# Altium schematic sheet Connector.SchDoc
size A4; SheetNumber: 6; SheetTotal: 11
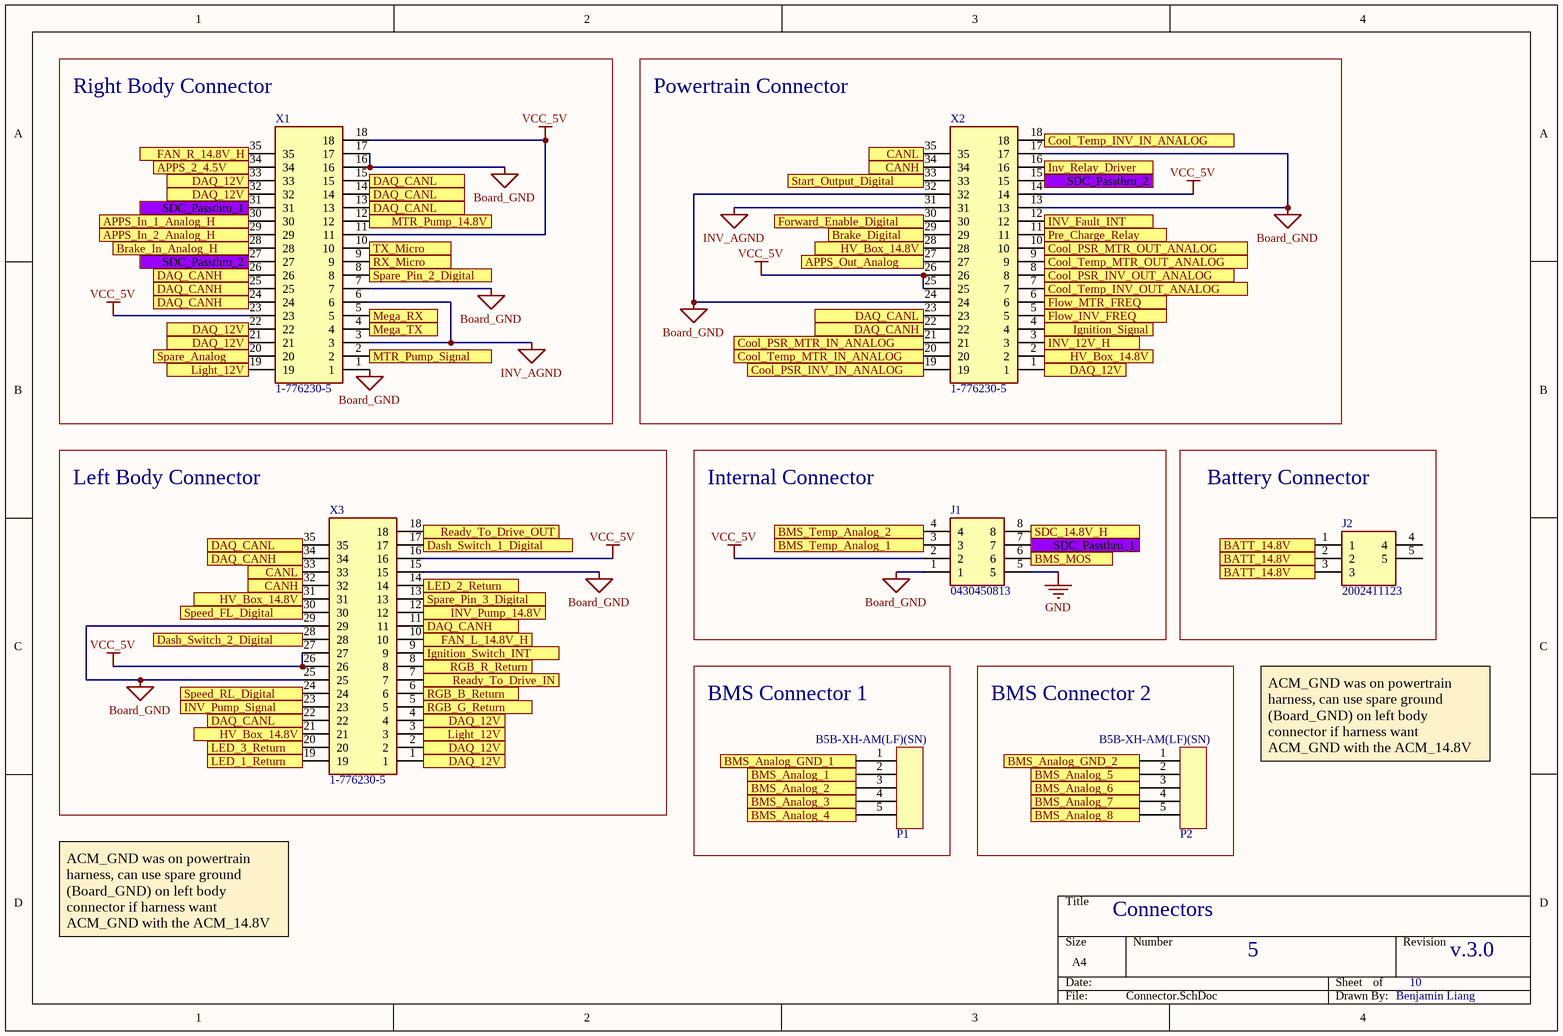
[diagram p0: Connector.SchDoc]

## Parts
J1  0430450813  [0430450813]
J2  2002411123  [2002411YY3_11/12/13]
P1  B5B-XH-AM(LF)(SN)  [B5B-XH-AM(LF)(SN)]  (value not drawn)
P2  B5B-XH-AM(LF)(SN)  [B5B-XH-AM(LF)(SN)]  (value not drawn)
X1  1-776230-5  [17762305]
X2  1-776230-5  [17762305]
X3  1-776230-5  [17762305]

## Blocks framed on the sheet
Right Body Connector: X1
Powertrain Connector: X2
Left Body Connector: X3
Internal Connector: J1
Battery Connector: J2
BMS Connector 1: P1
BMS Connector 2: P2

## Ports
APPS_2_4.5V, APPS_In_1_Analog_H, APPS_In_2_Analog_H, APPS_Out_Analog, BATT_14.8V, BMS_Analog_1, BMS_Analog_2, BMS_Analog_3, BMS_Analog_4, BMS_Analog_5, BMS_Analog_6, BMS_Analog_7, BMS_Analog_8, BMS_Analog_GND_1, BMS_Analog_GND_2, BMS_MOS, BMS_Temp_Analog_1, BMS_Temp_Analog_2, Brake_Digital, Brake_In_Analog_H, CANH, CANL, Cool_PSR_INV_IN_ANALOG, Cool_PSR_INV_OUT_ANALOG, Cool_PSR_MTR_IN_ANALOG, Cool_PSR_MTR_OUT_ANALOG, Cool_Temp_INV_IN_ANALOG, Cool_Temp_INV_OUT_ANALOG, Cool_Temp_MTR_IN_ANALOG, Cool_Temp_MTR_OUT_ANALOG, DAQ_12V, DAQ_CANH, DAQ_CANL, Dash_Switch_1_Digital, Dash_Switch_2_Digital, FAN_L_14.8V_H, FAN_R_14.8V_H, Flow_INV_FREQ, Flow_MTR_FREQ, Forward_Enable_Digital, HV_Box_14.8V, Ignition_Signal, Ignition_Switch_INT, INV_12V_H, INV_Fault_INT, INV_Pump_14.8V, INV_Pump_Signal, Inv_Relay_Driver, LED_1_Return, LED_2_Return, LED_3_Return, Light_12V, Mega_RX, Mega_TX, MTR_Pump_14.8V, MTR_Pump_Signal, Pre_Charge_Relay, Ready_To_Drive_IN, Ready_To_Drive_OUT, RGB_B_Return, RGB_G_Return, RGB_R_Return, RX_Micro, SDC_14.8V_H, SDC_Passthru_1, SDC_Passthru_2, Spare_Analog, Spare_Pin_2_Digital, Spare_Pin_3_Digital, Speed_FL_Digital, Speed_RL_Digital, Start_Output_Digital, TX_Micro

## Nets
Board_GND: J1.1 X1.1 X1.7 X1.16 X1.17 X2.13 X2.17 X2.24 X2.32 X3.15 X3.25 X3.29
GND: J1.5
INV_AGND: X1.3 X1.6 X2.31
VCC_5V: J1.2 X1.11 X1.18 X1.23 X2.14 X2.25 X2.26 X3.16 X3.26 X3.27
APPS_2_4.5V: X1.34 ; port APPS_2_4.5V
APPS_In_1_Analog_H: X1.30 ; port APPS_In_1_Analog_H
APPS_In_2_Analog_H: X1.29 ; port APPS_In_2_Analog_H
APPS_Out_Analog: X2.27 ; port APPS_Out_Analog
BATT_14.8V: J2.1 J2.2 J2.3 ; port BATT_14.8V
BMS_Analog_1: P1.2 ; port BMS_Analog_1
BMS_Analog_2: P1.3 ; port BMS_Analog_2
BMS_Analog_3: P1.4 ; port BMS_Analog_3
BMS_Analog_4: P1.5 ; port BMS_Analog_4
BMS_Analog_5: P2.2 ; port BMS_Analog_5
BMS_Analog_6: P2.3 ; port BMS_Analog_6
BMS_Analog_7: P2.4 ; port BMS_Analog_7
BMS_Analog_8: P2.5 ; port BMS_Analog_8
BMS_Analog_GND_1: P1.1 ; port BMS_Analog_GND_1
BMS_Analog_GND_2: P2.1 ; port BMS_Analog_GND_2
BMS_MOS: J1.6 ; port BMS_MOS
BMS_Temp_Analog_1: J1.3 ; port BMS_Temp_Analog_1
BMS_Temp_Analog_2: J1.4 ; port BMS_Temp_Analog_2
Brake_Digital: X2.29 ; port Brake_Digital
Brake_In_Analog_H: X1.28 ; port Brake_In_Analog_H
CANH: X2.34 X3.32 ; port CANH
CANL: X2.35 X3.33 ; port CANL
Cool_PSR_INV_IN_ANALOG: X2.19 ; port Cool_PSR_INV_IN_ANALOG
Cool_PSR_INV_OUT_ANALOG: X2.8 ; port Cool_PSR_INV_OUT_ANALOG
Cool_PSR_MTR_IN_ANALOG: X2.21 ; port Cool_PSR_MTR_IN_ANALOG
Cool_PSR_MTR_OUT_ANALOG: X2.10 ; port Cool_PSR_MTR_OUT_ANALOG
Cool_Temp_INV_IN_ANALOG: X2.18 ; port Cool_Temp_INV_IN_ANALOG
Cool_Temp_INV_OUT_ANALOG: X2.7 ; port Cool_Temp_INV_OUT_ANALOG
Cool_Temp_MTR_IN_ANALOG: X2.20 ; port Cool_Temp_MTR_IN_ANALOG
Cool_Temp_MTR_OUT_ANALOG: X2.9 ; port Cool_Temp_MTR_OUT_ANALOG
DAQ_12V: X1.21 X1.22 X1.32 X1.33 X2.1 X3.1 X3.2 X3.4 ; port DAQ_12V
DAQ_CANH: X1.24 X1.25 X1.26 X2.22 X3.11 X3.34 ; port DAQ_CANH
DAQ_CANL: X1.13 X1.14 X1.15 X2.23 X3.22 X3.35 ; port DAQ_CANL
Dash_Switch_1_Digital: X3.17 ; port Dash_Switch_1_Digital
Dash_Switch_2_Digital: X3.28 ; port Dash_Switch_2_Digital
FAN_L_14.8V_H: X3.10 ; port FAN_L_14.8V_H
FAN_R_14.8V_H: X1.35 ; port FAN_R_14.8V_H
Flow_INV_FREQ: X2.5 ; port Flow_INV_FREQ
Flow_MTR_FREQ: X2.6 ; port Flow_MTR_FREQ
Forward_Enable_Digital: X2.30 ; port Forward_Enable_Digital
HV_Box_14.8V: X2.2 X2.28 X3.21 X3.31 ; port HV_Box_14.8V
Ignition_Signal: X2.4 ; port Ignition_Signal
Ignition_Switch_INT: X3.9 ; port Ignition_Switch_INT
INV_12V_H: X2.3 ; port INV_12V_H
INV_Fault_INT: X2.12 ; port INV_Fault_INT
INV_Pump_14.8V: X3.12 ; port INV_Pump_14.8V
INV_Pump_Signal: X3.23 ; port INV_Pump_Signal
Inv_Relay_Driver: X2.16 ; port Inv_Relay_Driver
LED_1_Return: X3.19 ; port LED_1_Return
LED_2_Return: X3.14 ; port LED_2_Return
LED_3_Return: X3.20 ; port LED_3_Return
Light_12V: X1.19 X3.3 ; port Light_12V
Mega_RX: X1.5 ; port Mega_RX
Mega_TX: X1.4 ; port Mega_TX
MTR_Pump_14.8V: X1.12 ; port MTR_Pump_14.8V
MTR_Pump_Signal: X1.2 ; port MTR_Pump_Signal
Pre_Charge_Relay: X2.11 ; port Pre_Charge_Relay
Ready_To_Drive_IN: X3.7 ; port Ready_To_Drive_IN
Ready_To_Drive_OUT: X3.18 ; port Ready_To_Drive_OUT
RGB_B_Return: X3.6 ; port RGB_B_Return
RGB_G_Return: X3.5 ; port RGB_G_Return
RGB_R_Return: X3.8 ; port RGB_R_Return
RX_Micro: X1.9 ; port RX_Micro
SDC_14.8V_H: J1.8 ; port SDC_14.8V_H
SDC_Passthru_1: J1.7 X1.31 ; port SDC_Passthru_1
SDC_Passthru_2: X1.27 X2.15 ; port SDC_Passthru_2
Spare_Analog: X1.20 ; port Spare_Analog
Spare_Pin_2_Digital: X1.8 ; port Spare_Pin_2_Digital
Spare_Pin_3_Digital: X3.13 ; port Spare_Pin_3_Digital
Speed_FL_Digital: X3.30 ; port Speed_FL_Digital
Speed_RL_Digital: X3.24 ; port Speed_RL_Digital
Start_Output_Digital: X2.33 ; port Start_Output_Digital
TX_Micro: X1.10 ; port TX_Micro

Not connected (* = marked no-connect by the designer): J2 4 5

## Notes on the sheet
- (near P1) B5B-XH-AM(LF)(SN)
- (near P2) B5B-XH-AM(LF)(SN)
- ACM_GND was on powertrain harness, can use spare ground (Board_GND) on left body connector if harness want ACM_GND with the ACM_14.8V
- Connectors
- 5
- 10
- v.3.0
- Benjamin Liang

## Library data of the parts
J1 = 0430450813: Connector; Manufacturer_Name: Molex; Datasheet Link: https://media.digikey.com/pdf/Data%20Sheets/Molex%20PDFs/PK-70873-05xx_1_N3.pdf; Height: 10.16mm; Manufacturer_Part_Number: 0430450813; Arrow Part Number: 0430450813; Arrow Price/Stock: https://www.arrow.com/en/products/0430450813/molex
J2 = 2002411123: Connector; Manufacturer_Name: Molex; Datasheet Link: https://www.molex.com/pdm_docs/sd/2002411113_sd.pdf; Height: 17.5mm; Manufacturer_Part_Number: 2002411123
P1 P2 = B5B-XH-AM(LF)(SN): JST, Connector Header, 5 Position, 2.5mm, Through Hole, Shrouded - 4 Wall, Press-Fit, Solder, Detent Lock, Natural; Contact Resistance: 20mR; Max Current Rating: 3A; Number of Positions: 5; Max Voltage Rating (AC): 250V; Connector Type: Male Pin; Pitch: 0.098inch; Supplier 1: Digi-Key; Manufacturer: JST; Manufacturer Part Number: B5B-XH-AM(LF)(SN); RoHS: Yes; Category: Connectors; Stock 1: 3220; Pricing 1: 1=0.26000, 10=0.21900, 100=0.16880, 500=0.14286, 1000=0.11688, 5000=0.10389, 10000=0.09415 (USD); Mount: Through Hole; Contact Material: Brass; Contact Plating: Tin,Copper,Lead; Color: Green; Housing Color: White; Housing Material: Polyamide; Min Operating Temperature: -25°C; Max Operating Temperature: 85°C; Number of Rows: 1; Packaging: Bulk; Termination: Press-Fit; Fastening Type: Detent; Orientation: Straight; Series: XH; Contact Type: Male Pin; Length: 14.9mm; Depth: 5.75mm; Lead Free: Lead Free; ComponentLink1URL: https://datasheet.ciiva.com/26894/getdatasheetpartid-640829-26894480.pdf?src-supplier=Verical; ComponentLink1Description: https://datasheet.ciiva.com/26894/getdatasheetpartid-640829-26894480.pdf?src-supplier=Verical; ComponentLink2URL: https://datasheet.ciiva.com/726/exh-726396.pdf?src-supplier=Digi-Key; ComponentLink2Description: https://datasheet.ciiva.com/726/exh-726396.pdf?src-supplier=Digi-Key
X1-X3 = 1-776230-5: Connector; Manufacturer_Name: TE Connectivity; Datasheet Link: https://www.te.com/commerce/DocumentDelivery/DDEController?Action=showdoc&DocId=Customer+Drawing%7F776230%7FA11%7Fpdf%7FEnglish%7FENG_CD_776230_A11.pdf%7F1-776230-5; Height: 34.25mm; Manufacturer_Part_Number: 1-776230-5; Mouser Part Number: 571-1-776230-5; Mouser Price/Stock: https://www.mouser.co.uk/ProductDetail/TE-Connectivity-AMP/1-776230-5?qs=YqNA2qefETCOX%252BF7Gna1xg%3D%3D